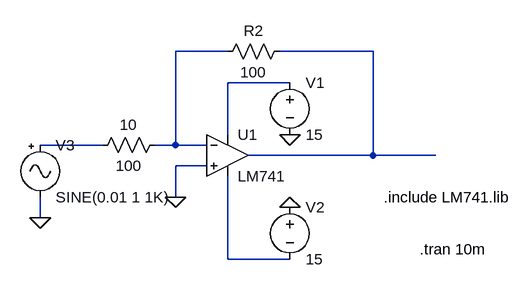
[diagram p0: schematic opamp part-1.asc]
opamp part-1.asc, the LTspice schematic file:
Version 4
SHEET 1 880 680
WIRE 384 192 304 192
WIRE 608 192 464 192
WIRE 480 240 384 240
WIRE 384 320 384 240
WIRE 192 336 96 336
WIRE 304 336 304 192
WIRE 304 336 272 336
WIRE 352 336 304 336
WIRE 608 352 608 192
WIRE 608 352 416 352
WIRE 704 352 608 352
WIRE 352 368 304 368
WIRE 304 416 304 368
WIRE 96 448 96 416
WIRE 384 512 384 384
WIRE 480 512 384 512
FLAG 304 416 0
FLAG 480 320 0
FLAG 480 432 0
FLAG 96 448 0
SYMBOL res 480 176 R90
WINDOW 0 0 56 VBottom 2
WINDOW 3 32 56 VTop 2
SYMATTR InstName R2
SYMATTR Value 100
SYMBOL res 288 320 R90
WINDOW 0 0 56 VBottom 2
WINDOW 3 32 56 VTop 2
SYMATTR InstName 10
SYMATTR Value 100
SYMBOL voltage 480 224 R0
SYMATTR InstName V1
SYMATTR Value 15
SYMBOL voltage 480 416 R0
SYMATTR InstName V2
SYMATTR Value 15
SYMBOL Misc/signal 96 320 R0
SYMATTR InstName V3
SYMATTR Value SINE(0.01 1 1K)
SYMBOL LM741 384 288 R0
SYMATTR InstName U1
TEXT 680 496 Left 2 !.tran 10m
TEXT 624 416 Left 2 !.include LM741.lib

The netlist it stands for:
* opamp part-1.asc
R2 N002 N001 100
R§10 N001 N004 100
V1 N003 0 15
V2 0 N005 15
V3 N004 0 SINE(0.01 1 1K)
XU1 0 N001 N003 N005 N002 LM741  ; pins In+ In- V+ V- OUT
.tran 10m
.include LM741.lib
.lib LM741.lib
.backanno
.end